# EAGLE schematic sensorenhet (EAGLE 6.4)
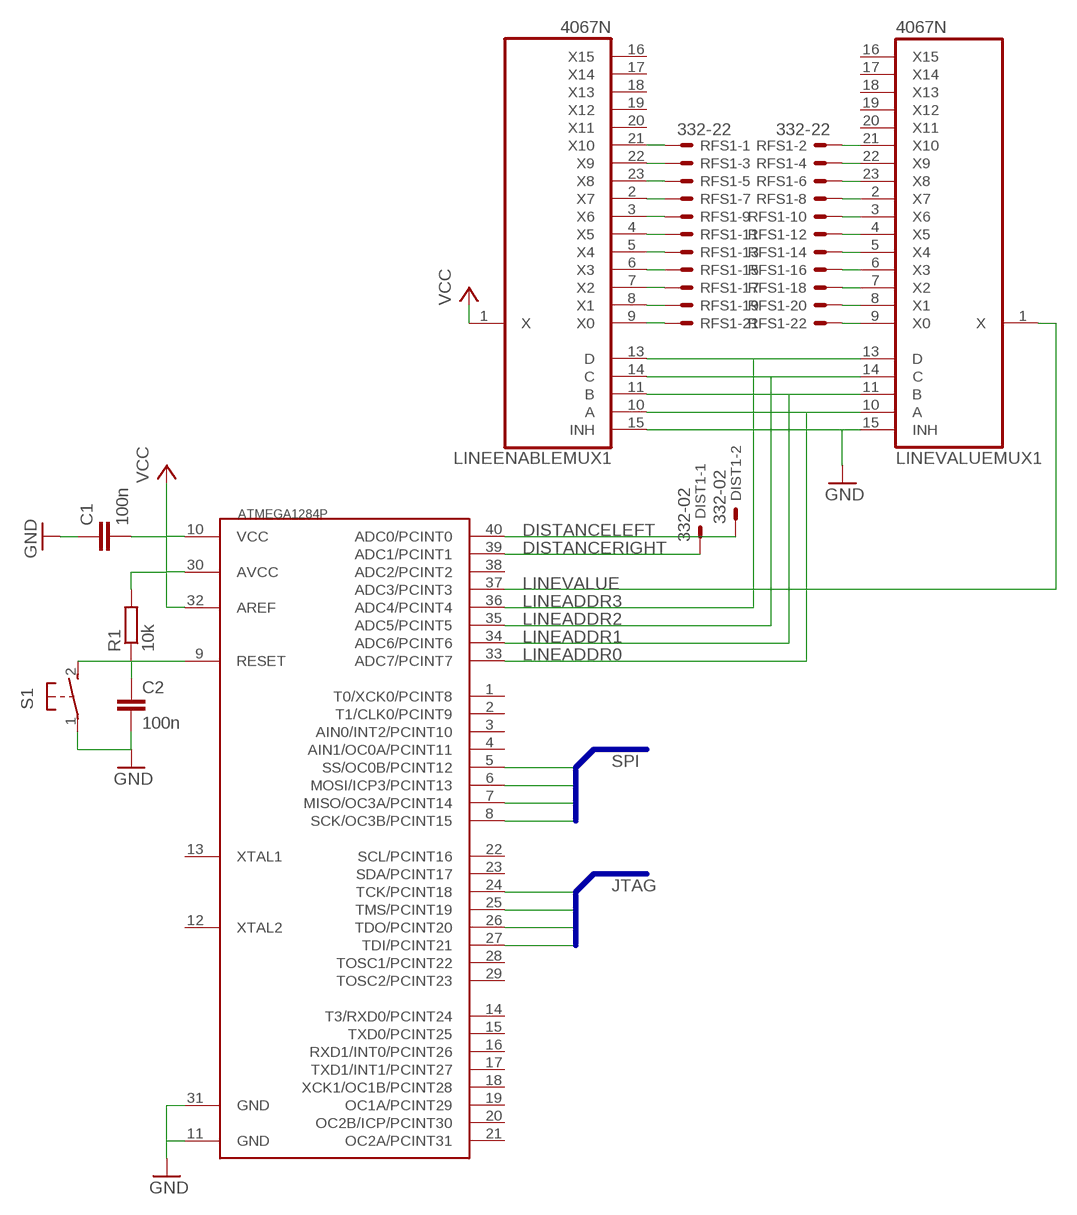
[diagram p0: schematic, sheet 1]

## Parts
ATMEGA1284P  MEGA1284P  [DIL40]
C1  100n  C-EUC1206  [C1206]
C2  100n  C-EUC1206  [C1206]
DIST1  332-02  [332-02]
LINEENABLEMUX1  4067N  [DIL24-6]
LINEVALUEMUX1  4067N  [DIL24-6]
R1  10k  R-EU_V235/17  [V235/17]
RFS1  332-22  [332-22]
S1  31-XX  [B3F-31XX]

## Nets
DISTANCELEFT: ATMEGA1284P.40(ADC0/PCINT0) DIST1.2
DISTANCERIGHT: ATMEGA1284P.39(ADC1/PCINT1) DIST1.1
GND: ATMEGA1284P.11(GND) ATMEGA1284P.31(GND) C1.1 C2.2 LINEENABLEMUX1.15(INH) LINEVALUEMUX1.15(INH) S1.1(P)
LINEADDR0: ATMEGA1284P.33(ADC7/PCINT7) LINEENABLEMUX1.10(A) LINEVALUEMUX1.10(A)
LINEADDR1: ATMEGA1284P.34(ADC6/PCINT6) LINEENABLEMUX1.11(B) LINEVALUEMUX1.11(B)
LINEADDR2: ATMEGA1284P.35(ADC5/PCINT5) LINEENABLEMUX1.14(C) LINEVALUEMUX1.14(C)
LINEADDR3: ATMEGA1284P.36(ADC4/PCINT4) LINEENABLEMUX1.13(D) LINEVALUEMUX1.13(D)
LINEVALUE: ATMEGA1284P.37(ADC3/PCINT3) LINEVALUEMUX1.1(X)
N$32: ATMEGA1284P.8(SCK/OC3B/PCINT15)
N$33: ATMEGA1284P.7(MISO/OC3A/PCINT14)
N$34: ATMEGA1284P.6(MOSI/ICP3/PCINT13)
N$35: ATMEGA1284P.5(SS/OC0B/PCINT12)
N$36: ATMEGA1284P.24(TCK/PCINT18)
N$37: ATMEGA1284P.25(TMS/PCINT19)
N$38: ATMEGA1284P.26(TDO/PCINT20)
N$39: ATMEGA1284P.27(TDI/PCINT21)
N$40: LINEENABLEMUX1.9(X0) RFS1.21
N$41: LINEENABLEMUX1.8(X1) RFS1.19
N$42: LINEENABLEMUX1.7(X2) RFS1.17
N$43: LINEENABLEMUX1.6(X3) RFS1.15
N$44: LINEENABLEMUX1.5(X4) RFS1.13
N$45: LINEENABLEMUX1.3(X6) RFS1.9
N$46: LINEENABLEMUX1.2(X7) RFS1.7
N$47: LINEENABLEMUX1.23(X8) RFS1.5
N$48: LINEENABLEMUX1.22(X9) RFS1.3
N$49: LINEENABLEMUX1.21(X10) RFS1.1
N$51: LINEENABLEMUX1.4(X5) RFS1.11
N$52: LINEVALUEMUX1.21(X10) RFS1.2
N$53: LINEVALUEMUX1.22(X9) RFS1.4
N$54: LINEVALUEMUX1.23(X8) RFS1.6
N$55: LINEVALUEMUX1.2(X7) RFS1.8
N$56: LINEVALUEMUX1.3(X6) RFS1.10
N$57: LINEVALUEMUX1.4(X5) RFS1.12
N$58: LINEVALUEMUX1.5(X4) RFS1.14
N$59: LINEVALUEMUX1.6(X3) RFS1.16
N$60: LINEVALUEMUX1.7(X2) RFS1.18
N$61: LINEVALUEMUX1.8(X1) RFS1.20
N$62: LINEVALUEMUX1.9(X0) RFS1.22
N$65: ATMEGA1284P.9(RESET) C2.1 R1.1 S1.2(S)
VCC: ATMEGA1284P.10(VCC) ATMEGA1284P.30(AVCC) ATMEGA1284P.32(AREF) C1.2 LINEENABLEMUX1.1(X) R1.2
Unconnected: ATMEGA1284P.1(T0/XCK0/PCINT8) ATMEGA1284P.2(T1/CLK0/PCINT9) ATMEGA1284P.3(AIN0/INT2/PCINT10) ATMEGA1284P.4(AIN1/OC0A/PCINT11) ATMEGA1284P.12(XTAL2) ATMEGA1284P.13(XTAL1) ATMEGA1284P.14(T3/RXD0/PCINT24) ATMEGA1284P.15(TXD0/PCINT25) ATMEGA1284P.16(RXD1/INT0/PCINT26) ATMEGA1284P.17(TXD1/INT1/PCINT27) ATMEGA1284P.18(XCK1/OC1B/PCINT28) ATMEGA1284P.19(OC1A/PCINT29) ATMEGA1284P.20(OC2B/ICP/PCINT30) ATMEGA1284P.21(OC2A/PCINT31) ATMEGA1284P.22(SCL/PCINT16) ATMEGA1284P.23(SDA/PCINT17) ATMEGA1284P.28(TOSC1/PCINT22) ATMEGA1284P.29(TOSC2/PCINT23) ATMEGA1284P.38(ADC2/PCINT2) LINEENABLEMUX1.16(X15) LINEENABLEMUX1.17(X14) LINEENABLEMUX1.18(X13) LINEENABLEMUX1.19(X12) LINEENABLEMUX1.20(X11) LINEVALUEMUX1.16(X15) LINEVALUEMUX1.17(X14) LINEVALUEMUX1.18(X13) LINEVALUEMUX1.19(X12) LINEVALUEMUX1.20(X11)

## Buses
SPI
JTAG

## Power pins joined to a net without a drawn wire
VDD: LINEENABLEMUX1.24(VDD) LINEVALUEMUX1.24(VDD)
VSS: LINEENABLEMUX1.12(VSS) LINEVALUEMUX1.12(VSS)

## Library data of the parts
ATMEGA1284P = 1284p:MEGA1284P: Atmel ATmega1284P 8-bit AVR Microcontroller
C1 C2 = rcl:C-EU: CAPACITOR, European symbol
DIST1 = con-garry:332-02: 2 Pin - 2mm Dual Row Source: www.mpe-connector.de / garry_shortform_2012.pdf
LINEENABLEMUX1 LINEVALUEMUX1 = 40xx:4067: 16-channel ANALOG MULTIPLEXER
R1 = resistor:R-EU_: RESISTOR, European symbol
RFS1 = con-garry:332-22: 22 Pin - 2mm Dual Row Source: www.mpe-connector.de / garry_shortform_2012.pdf
S1 = switch-omron:31-XX: OMRON SWITCH; MPN: B3F-3100; OC_FARNELL: 959704; OC_NEWARK: 36M3582